# Altium schematic sheet GSM Power.SchDoc: GSM Power Switch and Filter
size 292 x 193 mm; DocumentNumber: 4; SheetNumber: 4; SheetTotal: 54
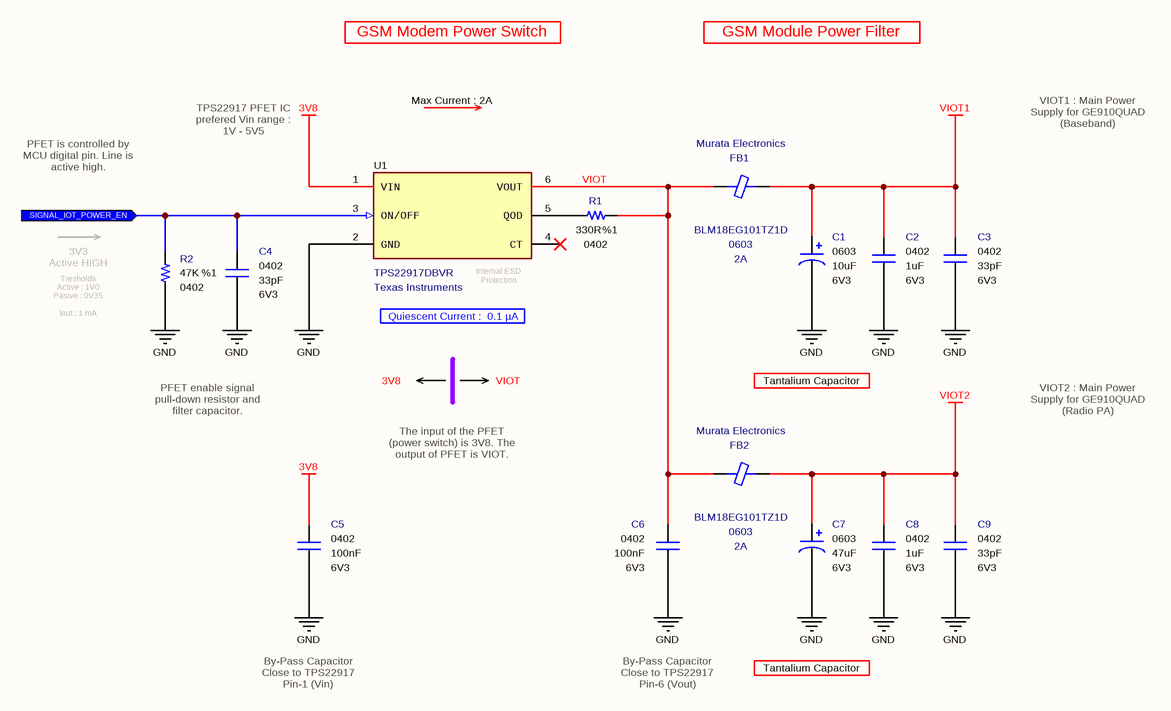
[diagram p0: GSM Power.SchDoc]

## Parts
C1  value 10uF  Case: 0603  Voltage: 6V3  [CAPACITOR_0603 - TANTALUM]  (hidden comment: Tantalum Capacitor)
C2  value 1uF  Case: 0402  Voltage: 6V3  [CAPACITOR_0402]  (hidden comment: Multilayer Ceramic Capacitor)
C3  value 33pF  Case: 0402  Voltage: 6V3  [CAPACITOR_0402]  (hidden comment: Multilayer Ceramic Capacitor)
C4  value 33pF  Case: 0402  Voltage: 6V3  [CAPACITOR_0402]  (hidden comment: Multilayer Ceramic Capacitor)
C5  value 100nF  Case: 0402  Voltage: 6V3  [CAPACITOR_0402]  (hidden comment: Multilayer Ceramic Capacitor)
C6  value 100nF  Case: 0402  Voltage: 6V3  [CAPACITOR_0402]  (hidden comment: Multilayer Ceramic Capacitor)
C7  value 47uF  Case: 0603  Voltage: 6V3  [CAPACITOR_0603 - TANTALUM]  (hidden comment: Tantalum Capacitor)
C8  value 1uF  Case: 0402  Voltage: 6V3  [CAPACITOR_0402]  (hidden comment: Multilayer Ceramic Capacitor)
C9  value 33pF  Case: 0402  Voltage: 6V3  [CAPACITOR_0402]  (hidden comment: Multilayer Ceramic Capacitor)
FB1  value BLM18EG101TZ1D  Case: 0603  Maximum DC Current: 2A  Manufacturer Name: Murata Electronics  [INDUCATOR_0603]  (hidden comment: Ferrite Bead)
FB2  value BLM18EG101TZ1D  Case: 0603  Maximum DC Current: 2A  Manufacturer Name: Murata Electronics  [INDUCATOR_0603]  (hidden comment: Ferrite Bead)
R1  value 330R  Tolerance: %1  Case: 0402  [RESISTOR_0402]  (hidden comment: 330R - 0402 - %1 - 1/16W)
R2  value 47K  Tolerance: %1  Case: 0402  [RESISTOR_0402]  (hidden comment: 47K - 0402 - %1 - 1/16W)
U1  Manufacturer Part Number: TPS22917DBVR  Manufacturer Name: Texas Instruments  [SOT-23-6]  (hidden comment: Power Switch)

## Ports
SIGNAL_IOT_POWER_EN (in)

## Nets
3V8: C5.1 U1.1(VIN)
GND: C1.2 C2.1 C3.1 C4.1 C5.2 C6.2 C7.2 C8.1 C9.1 R2.1 U1.2(GND)
VIOT1: C1.1 C2.2 C3.2 FB1.2
VIOT2: C7.1 C8.2 C9.2 FB2.2
SIGNAL_IOT_POWER_EN: C4.2 R2.2 U1.3(ON/OFF) ; port SIGNAL_IOT_POWER_EN
VIOT: C6.1 FB1.1 FB2.1 R1.1 U1.6(VOUT)
NetR1_2: R1.2 U1.5(QOD)

Not connected (* = marked no-connect by the designer): U1 4(CT)*

## Notes on the sheet
- GSM Modem Power Switch
- GSM Module Power Filter
- TPS22917 PFET IC prefered Vin range : 1V - 5V5
- Max Current : 2A
- VIOT1 : Main Power Supply for GE910QUAD (Baseband)
- PFET is controlled by MCU digital pin. Line is active high.
- (near R2) 3V3
  Active HIGH
- (near U1) Internal ESD Protection
- (near R2) Tresholds
  Active : 1V0
  Pasive : 0V35
  Iout : 1 mA
- Quiescent Current :  0.1 µA
- PFET enable signal pull-down resistor and filter capacitor.
- 3V8
- VIOT
- Tantalium Capacitor
- VIOT2 : Main Power Supply for GE910QUAD (Radio PA)
- The input of the PFET (power switch) is 3V8. The output of PFET is VIOT.
- By-Pass Capacitor
  Close to TPS22917
  Pin-1 (Vin)
- By-Pass Capacitor
  Close to TPS22917
  Pin-6 (Vout)
- © 2021 All rights reserved.
  This document may not, in whole or in part, be copied, photocopied, reproduced, translated or converted to any electronic or machine readable from without prior written permission of Mehmet Günce Akkoyun.
  Engineer contact : akkoyun@me.com
- Property of
- Engineer :
- Date :
- Size :
- A4
- Time :
- Project :
- Page :
- /
- Customer :
- Product ID :
- Module ID :
- Version :
- File :
- Revision :

## Library data of the parts
C1 = Capacitor - 10uF [0603-6V3] (Tantalium): Capacitor - 10uF [0603] (Tantalium); Manufacturer Name: AVX; Manufacturer Part Number: F380J106MMAAH3; ESR: 200 mOhms; Leakage Current: 10uA; Tolerance: 20%; Height: 0.8mm; Maximum Operating Temperature: +105; Minimum Operating Temperature: -55; ROHS: Yes; ComponentLink1Description: DataSheet; ComponentLink1URL: https://www.mouser.com.tr/datasheet/2/40/f38-775706.pdf; ComponentLink2Description: Mouser; ComponentLink2URL: https://www.mouser.com.tr/ProductDetail/AVX/F380J106MMAAH3?qs=sGAEpiMZZMtZ1n0r9vR22fixilZl6Mr8zRKleESmvcDFwZ4LSyC6Pg%3D%3D; Supplier 1: Mouser; Supplier 2: Digi-Key; Supplier Part Number 2: 478-12031-1-ND; Supplier Part Number 1: 581-F380J106MMAAH3; Mouser Part Number: 581-F380J106MMAAH3
C2 C8 = Capacitor - 1uF [0402-6V3]: Capacitor - 1uF [0402] (Ceramic); Manufacturer Name: Murata Electronics; Manufacturer Part Number: GRM153R60J105ME95D; Dielectric: X5R; Tolerance: 20%; Height: 0.3mm; Maximum Operating Temperature: +85; Minimum Operating Temperature: -55; RoHS: Yes; Weight: 6mg; ComponentLink1Description: DataSheet; ComponentLink1URL: https://psearch.en.murata.com/capacitor/product/GRM153R60J105ME95%23.html; ComponentLink2Description: Mouser; ComponentLink2URL: https://www.mouser.com/Search/Refine.aspx?Keyword=81-GRM153R60J105ME5D; Supplier 1: Future Electronics; Supplier 2: Future Electronics; Supplier 3: Mouser; Supplier 4: Arrow; Supplier 5: Digi-Key; Supplier Part Number 5: 490-14576-1-ND; Supplier Part Number 4: GRM153R60J105ME95D; Supplier Part Number 3: 81-GRM153R60J105ME5D; Supplier Part Number 2: GRM153R60J105ME95D-REEL; Supplier Part Number 1: GRM153R60J105ME95D-CUTT; Mouser Part Number: 81-GRM153R60J105ME5D
C3 C4 C9 = Capacitor - 33pF [0402-6V3]: Capacitor - 33pF [0402] (Ceramic); Manufacturer Name: Kemet; Manufacturer Part Number: C0402C330J9RACAUTO; Dielectric: X7R; Tolerance: 10%; Height: 0.5mm; Maximum Operating Temperature: +125; Minimum Operating Temperature: -55; ROHS: Yes; ComponentLink1Description: DataSheet; ComponentLink1URL: https://api.kemet.com/component-edge/download/datasheet/C0402C330J9RACAUTO.pdf; ComponentLink2Description: Mouser; ComponentLink2URL: https://www.mouser.com/Search/Refine.aspx?Keyword=80-C0402C330J9RAUTO; Supplier 1: Mouser; Supplier Part Number 1: 80-C0402C330J9RAUTO; Mouser Part Number: 80-C0402C330J9RAUTO
C5 C6 = Capacitor - 100nF [0402-6V3]: Capacitor - 100nF [0402-6V3] (Ceramic); Manufacturer Name: AVX; Manufacturer Part Number: 04026D104KAT4A; Dielectric: X5R; Tolerance: %10; Height: 0.25mm; ComponentLink1Description: Mouser; ComponentLink1URL: https://www.mouser.com.tr/ProductDetail/AVX/04026D104KAT4A?qs=sGAEpiMZZMs0AnBnWHyRQPg4iYkCw7IMED%2F4kpqgf7w%3D; ComponentLink2Description: DataSheet; ComponentLink2URL: https://www.mouser.com.tr/datasheet/2/40/cx5r-776519.pdf; ROHS: Yes; Maximum Operating Temperature: +85; Minimum Operating Temperature: -55; Supplier 1: Avnet; Supplier Part Number 1: 04026D104KAT4A; Mouser Part Number: 581-04026D104KAT4A
C7 = Capacitor - 47u [0603-6V3] (Tantalium): Capacitor - 47uF [0603] (Tantalium); Manufacturer Name: AVX; Manufacturer Part Number: F380J476MMAAXEH3; ESR: 300 mOhms; Leakage Current: 59.2uA; Tolerance: 20%; Height: 0.8 mm; Maximum Operating Temperature: +105; Minimum Operating Temperature: -55; ROHS: Yes; Weight: 2mg; ComponentLink1Description: DataSheet; ComponentLink1URL: https://www.mouser.com.tr/datasheet/2/40/f38-775706.pdf; ComponentLink2Description: Mouser; ComponentLink2URL: https://www.mouser.com.tr/ProductDetail/AVX/F380J476MMAAXEH3?qs=sGAEpiMZZMtZ1n0r9vR22RxGXmrWTp1dAwL15%252BtiGosce1Uk5KTrYw%3D%3D; Supplier 1: Avnet; Supplier Part Number 1: F380J476MMAAXEH3; Mouser Part Number: 581-F380J476MMAAXEH3
FB1 FB2 = Ferrite Bead - 2A [0603]: Ferrite Beads 0603 100ohms 2000mA Auto Infotainment; Tolerance: 25%; Maximum DC Resistance: 45 mOhms; Height: 0.75mm; ROHS: Yes; Minimum Operating Temperature: -55; Maximum Operating Temperature: +125; Impedance: 100 Ohms; ComponentLink1Description: DataSheet; ComponentLink1URL: http://www.murata.com/~/media/webrenewal/support/library/catalog/products/emc/emifil/c31e.ashx?la=en-gb; ComponentLink2Description: Mouser; ComponentLink2URL: https://www.mouser.com/Search/Refine.aspx?Keyword=81-BLM18EG101TZ1D; Supplier 1: Mouser; Supplier Part Number 1: 81-BLM18EG101TZ1D; Manufacturer Part Number: BLM18EG101TZ1D; Mouser Part Number: 81-BLM18EG101TZ1D; Mouser Price/Stock: https://www.mouser.com/Search/Refine.aspx?Keyword=81-BLM18EG101TZ1D
R1 = Resistor - 330R: Thick Film Resistors - SMD 1/16 W 330 Ohm 1%; Manufacturer Name: Vishay; Manufacturer Part Number: CRCW0402330RFKED; Height: 0.4mm; ComponentLink1Description: DataSheet; ComponentLink1URL: https://www.mouser.com.tr/datasheet/2/427/dcrcwe3-1762152.pdf; ComponentLink2Description: Mouser; ComponentLink2URL: https://www.mouser.com.tr/ProductDetail/Vishay-Dale/CRCW0402330RFKED?qs=sGAEpiMZZMu61qfTUdNhG2DpbjADlD3GGS6SwBlLi5Q%3D; Supplier 1: Digi-Key; Supplier 2: Digi-Key; Supplier Part Number 2: 541-330LDKR-ND; Supplier Part Number 1: 541-330LCT-ND; Mouser Part Number: 71-CRCW0402-330-E3; Supplier 3: Digi-Key; Supplier 4: Newark; Supplier 5: Newark; Supplier 6: RSComponents; Supplier 7: RSComponents; Supplier 8: Future Electronics; Supplier 9: Future Electronics; Supplier 10: Newark; Supplier 11: Newark; Supplier 12: Arrow Electronics; Supplier 13: Mouser; Supplier 14: Avnet; Supplier 15: Farnell; Supplier 16: Farnell; Supplier 17: Farnell; Supplier 18: Allied Electronics; Supplier 19: Allied Electronics; Supplier 20: Avnet; Supplier 21: Avnet; Supplier 22: Future Electronics; Supplier 23: Future Electronics; Supplier 24: Newark; Supplier 25: RSComponents; Supplier 26: RSComponents; Supplier Part Number 3: 541-330LTR-ND; Supplier Part Number 4: 52K6981; Supplier Part Number 5: 61M5301; Supplier Part Number 6: 6789178P; Supplier Part Number 7: 6789178; Supplier Part Number 9: 9848185; Supplier Part Number 8: 4103726; Supplier Part Number 10: 25AC7117; Supplier Part Number 11: 42K3473; Supplier Part Number 26: 1819488; Supplier Part Number 25: 1688408; Supplier Part Number 24: 24W2220; Supplier Part Number 23: CRCW0402330RFKED-REEL; Supplier Part Number 22: CRCW0402330RFKED-CUTT; Supplier Part Number 21: 52K6981; Supplier Part Number 20: 42K3473; Supplier Part Number 19: 70272759; Supplier Part Number 18: 70202255; Supplier Part Number 17: 1469709RL; Supplier Part Number 16: 2121540; Supplier Part Number 15: 1469709; Supplier Part Number 14: CRCW0402330RFKED; Supplier Part Number 13: 71-CRCW0402-330-E3; Supplier Part Number 12: CRCW0402330RFKED
R2 = Resistor - 47K: Thick Film Resistors - SMD 1/16 W 47 Kohms 1%; Manufacturer Name: Vishay; Manufacturer Part Number: CRCW040247K0FKED; Height: 0.4mm; ComponentLink1Description: DataSheet; ComponentLink1URL: https://www.mouser.com.tr/datasheet/2/427/dcrcwe3-1762152.pdf; ComponentLink2Description: Mouser; ComponentLink2URL: https://www.mouser.com.tr/ProductDetail/Vishay-Dale/CRCW040247K0FKED?qs=sGAEpiMZZMu61qfTUdNhG2DpbjADlD3GL%252B3h1elTxqU%3D; Supplier 1: RSComponents; Supplier 2: Newark; Supplier Part Number 1: 6789361P; Supplier Part Number 2: 52K7097; Supplier 3: Avnet; Supplier 4: RSComponents; Supplier 5: Future Electronics; Supplier 6: Future Electronics; Supplier 7: Newark; Supplier 8: Arrow Electronics; Supplier 9: Mouser; Supplier 10: Newark; Supplier 11: Avnet; Supplier 12: Digi-Key; Supplier 13: Digi-Key; Supplier 14: Digi-Key; Supplier 15: Newark; Supplier 16: Farnell; Supplier 17: Farnell; Supplier 18: Farnell; Supplier 19: Allied Electronics; Supplier 20: Allied Electronics; Supplier 21: Avnet; Supplier 22: Future Electronics; Supplier 23: Future Electronics; Supplier 24: Future Electronics; Supplier 25: Newark; Supplier 26: RSComponents; Supplier 27: RSComponents; Supplier Part Number 3: 52K7097; Supplier Part Number 4: 6789361; Supplier Part Number 5: 2103738; Supplier Part Number 6: 7521222; Supplier Part Number 7: 42K3500; Supplier Part Number 8: CRCW040247K0FKED; Supplier Part Number 12: 541-47.0KLCT-ND; Supplier Part Number 14: 541-47.0KLTR-ND; Supplier Part Number 10: 61M5310; Supplier Part Number 9: 71-CRCW0402-47K-E3; Supplier Part Number 13: 541-47.0KLDKR-ND; Supplier Part Number 11: CRCW040247K0FKED; Supplier Part Number 15: 25AC7165; Supplier Part Number 16: 1469719; Supplier Part Number 18: 2121814; Supplier Part Number 17: 1469719RL; Supplier Part Number 19: 70202660; Supplier Part Number 20: 70272767; Supplier Part Number 21: 42K3500; Supplier Part Number 22: 6128776; Supplier Part Number 24: CRCW040247K0FKED-REEL; Supplier Part Number 23: CRCW040247K0FKED-CUTT; Supplier Part Number 25: 24W2315; Supplier Part Number 26: 1688455; Supplier Part Number 27: 1823505
U1 = IC - TPS22917DBVR: Power Switch MosFet; Height: 1.45mm; ComponentLink1Description: DataSheet; ComponentLink1URL: http://www.ti.com/lit/gpn/tps22917; ComponentLink2Description: Mouser; ComponentLink2URL: https://www.mouser.com/Search/Refine.aspx?Keyword=595-TPS22917DBVR; Supplier 1: Mouser; Supplier 2: Digi-Key; Supplier Part Number 1: 595-TPS22917DBVR; Supplier Part Number 2: 296-50498-1-ND; Mouser Part Number: 595-TPS22917DBVR; Case: SOT-23-6